# EAGLE design INTERFACE (EAGLE 6.2)
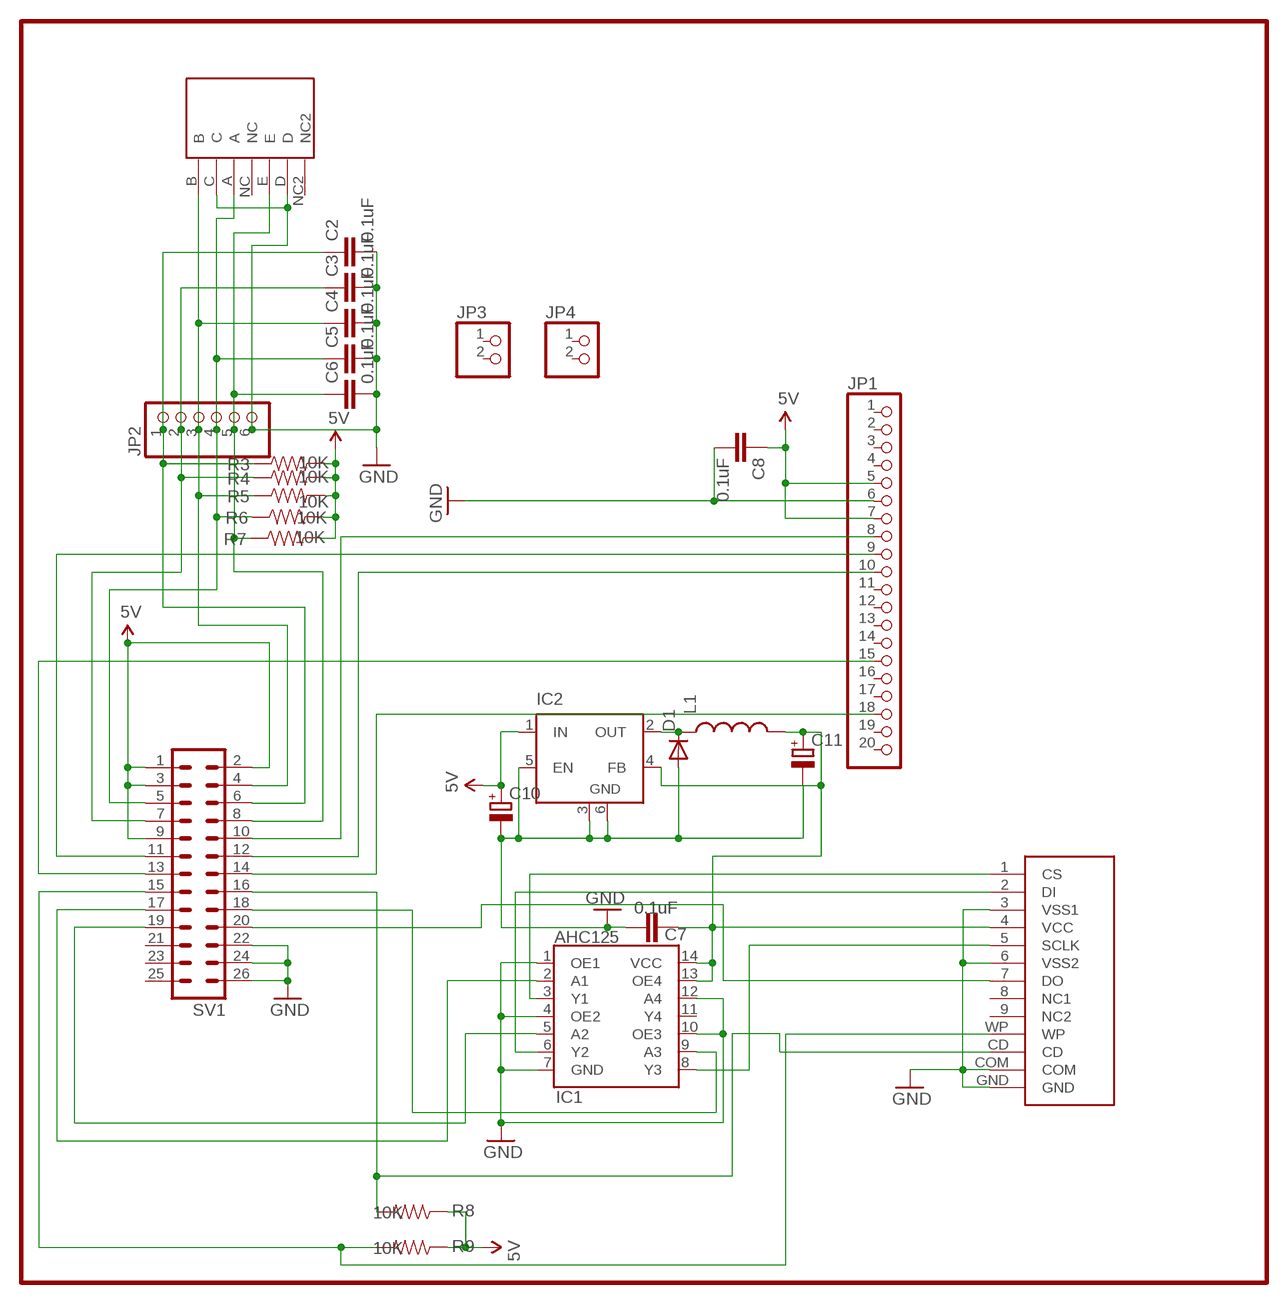
[diagram p0: schematic, sheet 1]

## Parts
C2  0.1uF  CAP0805  [0805]
C3  0.1uF  CAP0805  [0805]
C4  0.1uF  CAP0805  [0805]
C5  0.1uF  CAP0805  [0805]
C6  0.1uF  CAP0805  [0805]
C7  0.1uF  CAP0805  [0805]
C8  0.1uF  CAP0805  [0805]
C10  CPOL-EUE3.5-8  [E3,5-8]
C11  CPOL-EUE3.5-8  [E3,5-8]
D1  DIODESMB  [SMB-DIODE]
IC1  AHC125  [DIN14]
IC2  LM2596S  [TO263-5]
JP1  PINHD-1X20  [1X20]
JP2  PINHD-1X6  [1X06]
JP3  PINHD-1X2  [1X02]
JP4  PINHD-1X2  [1X02]
L1  INDUCTORPWR  [CDRH125]
Q2  SDCARD  [SDCARD]
R3  10K  RESISTOR  [0805]
R4  10K  RESISTOR  [0805]
R5  10K  RESISTOR  [0805]
R6  10K  RESISTOR  [0805]
R7  10K  RESISTOR  [0805]
R8  10K  RESISTOR  [0805]
R9  10K  RESISTOR  [0805]
S2  DJFS  [PIN5]
SV1  ML26  [ML26]

## Nets
5V: C8.1 C10.+ IC2.1(IN) JP1.5 JP1.7 R3.2 R4.2 R5.2 R6.2 R7.2 R8.1 R9.1 SV1.1 SV1.2 SV1.3 SV1.9
GND2: C2.2 C3.2 C4.2 C5.2 C6.2 C7.2 C8.2 C10.- C11.- D1.A IC1.1(OE1) IC1.4(OE2) IC1.7(GND) IC1.10(OE3) IC1.12(A4) IC2.3(GND) IC2.5(EN) IC2.6(GND) JP1.6 JP2.6 Q2.3(VSS1) Q2.6(VSS2) Q2.COM Q2.GND S2.C S2.D SV1.22 SV1.24 SV1.26 ; supply symbol labelled GND
N$1: D1.C IC2.2(OUT) L1.1
N$2: IC1.3(Y1) Q2.1(CS)
N$5: C2.1 JP2.1 R3.1 SV1.6
N$8: IC1.2(A1) SV1.17
N$10: IC1.6(Y2) Q2.2(DI)
N$12: Q2.CD R8.2 SV1.16
N$13: Q2.7(DO) SV1.20
N$18: JP1.15 SV1.13
N$19: JP1.8 SV1.10
N$20: JP1.10 SV1.12
N$21: JP1.9 SV1.11
N$22: JP1.18 SV1.14
N$23: IC1.8(Y3) Q2.5(SCLK)
N$27: C3.1 JP2.2 R4.1 SV1.7
N$28: C4.1 JP2.3 R5.1 S2.B SV1.4
N$29: C5.1 JP2.4 R6.1 S2.A SV1.5
N$30: C6.1 JP2.5 R7.1 S2.E SV1.8
N$31: Q2.WP R9.2 SV1.15
N$33: IC1.5(A2) SV1.19
N$34: C7.1 C11.+ IC1.13(OE4) IC1.14(VCC) IC2.4(FB) L1.2 Q2.4(VCC)
N$35: IC1.9(A3) SV1.18
Unconnected: IC1.11(Y4) JP1.1 JP1.2 JP1.3 JP1.4 JP1.11 JP1.12 JP1.13 JP1.14 JP1.16 JP1.17 JP1.19 JP1.20 JP3.1 JP3.2 JP4.1 JP4.2 Q2.8(NC1) Q2.9(NC2) S2.NC S2.NC2 SV1.21 SV1.23 SV1.25

## Library data of the parts
C2-C8 = SparkFun2:CAP: Capacitor Standard 0603 ceramic capacitor, and 0.1" leaded capacitor.
C10 C11 = rcl:CPOL-EU: POLARIZED CAPACITOR, European symbol
D1 = SparkFun:DIODE: Diode These are standard reverse protection diodes and small signal diodes. SMA package can handle up to about 1A. SOD-323 can handle about 200mA. What the SOD-323 package when ordering, there are some mfgs out there that are 5-pin packages.
IC1 = ahc:AHC125
IC2 = linear:LM2596S: STEP-DOWN VOLTAGE REGULATOR
JP1 = pinhead:PINHD-1X20: PIN HEADER
JP2 = pinhead:PINHD-1X6: PIN HEADER
JP3 JP4 = pinhead:PINHD-1X2: PIN HEADER
L1 = SparkFun:INDUCTOR: Inductors Basic Inductor/Choke - 0603 and 1206. Footprints are not proven and vary greatly between part numbers.
Q2 = sd:SDCARD
R3-R9 = SparkFun:RESISTOR: Resistor Basic schematic elements and footprints for 0603, 1206, and PTH 1/10th watt (small) resistors.
S2 = yjfs:DJFS
SV1 = con-harting-ml:ML26: HARTING; OC_FARNELL: unknown; OC_NEWARK: unknown

## Net classes
0 default: width 0.203 mm, drill 0.508 mm, clearance 0.203 mm
1 5V: width 0.381 mm, drill 0.508 mm, clearance 0.254 mm
2 gnd: width 0.381 mm, drill 0.508 mm, clearance 0.254 mm
3 3.3V: width 0.381 mm, drill 0.508 mm, clearance 0.254 mm

## Board
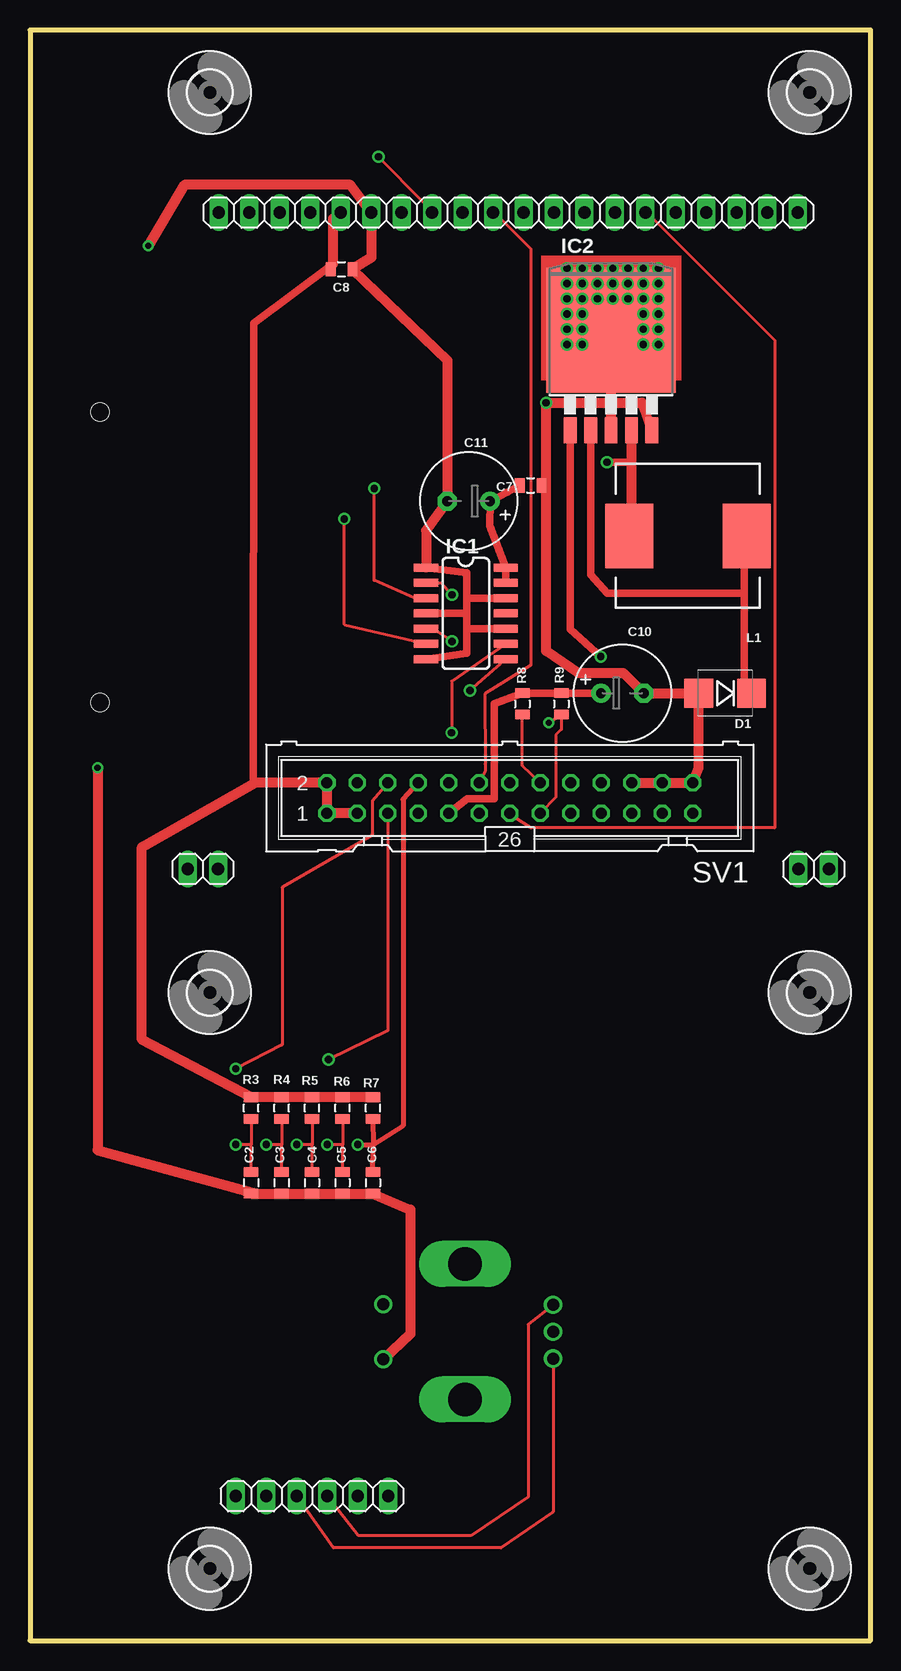
[diagram p1: board, top side]
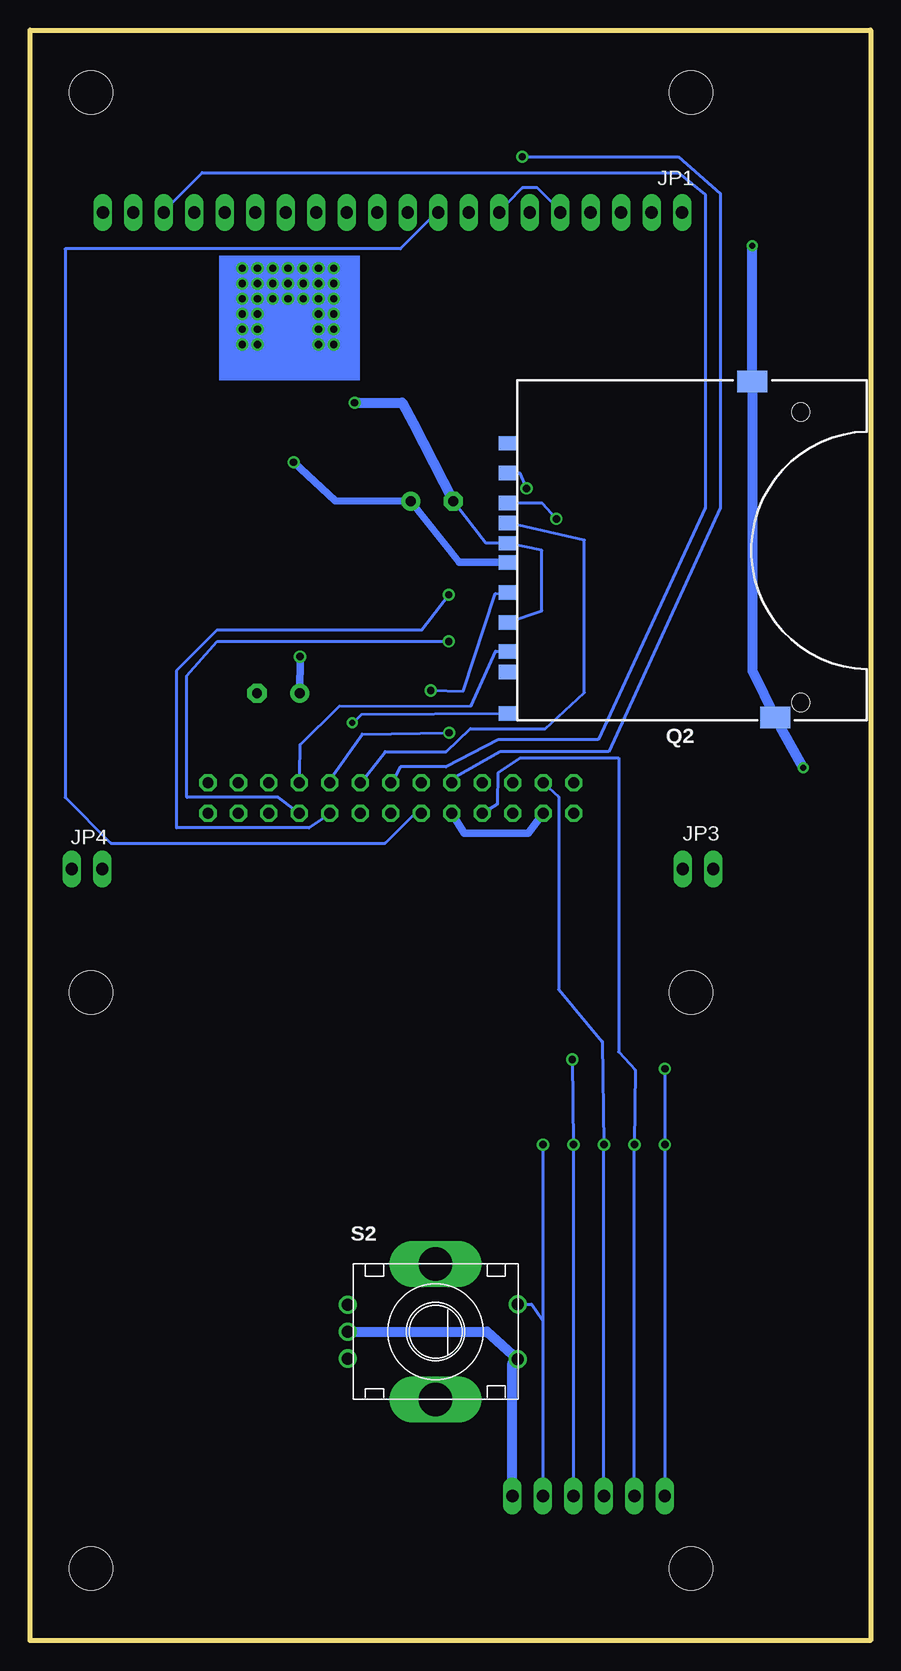
[diagram p2: board, bottom side, seen from below]

Size 70.06 x 134.21 mm. Coordinates in mm from the lower left corner, seen from the top.
Outline: 0,0 70.06,0 70.06,134.21 0,134.21 0,0
Copper layers (1*16): Top 0.035mm / dielectric 1.5mm / Bottom 0.035mm
Design rules: minimum track width 10mil, minimum drill 24mil, track to track 8mil, track to pad 8mil, pad to pad 8mil, via to via 8mil, smd to smd 8mil, copper to edge 40mil, drill to drill 8mil, minimum pad ring 10mil, minimum via ring 8mil, stop-mask expansion 4mil, vias tented up to drill 0mil, thermal gap 10mil

### Footprints (pad centres in the part's own frame; a part is rotated, then mirrored left to right if it is on the bottom)
0805 = smd 0.8 x 1.2: 1 -0.9,0; 2 0.9,0
E3,5-8 = drill 0.813 pad 1.6: + -1.778,0 | drill 0.813 pad 1.6 octagon: - 1.778,0
SMB-DIODE = smd 2.4 x 2.4: A 2.2,0; C -2.2,0
DIN14 = smd 0.66 x 2.032: 1 -3.175,-3.315; 2 -1.905,-3.315; 3 -0.635,-3.315; 4 0.635,-3.315; 5 1.905,-3.315; 6 3.175,-3.315; 7 4.445,-3.315; 8 4.445,3.315; 9 3.175,3.315; 10 1.905,3.315; 11 0.635,3.315; 12 -0.635,3.315; 13 -1.905,3.315; 14 -3.175,3.315
TO263-5 = smd 1.067 x 2.159: 1 -3.404,-5.791; 2 -1.702,-5.791; 3 0,-5.791; 4 1.702,-5.791; 5 3.404,-5.791 | smd 10.8 x 10.41: 6 0,2.54
1X20 = drill 1.016 long: 1 -24.13,0; 2 -21.59,0; 3 -19.05,0; 4 -16.51,0; 5 -13.97,0; 6 -11.43,0; 7 -8.89,0; 8 -6.35,0; 9 -3.81,0; 10 -1.27,0; 11 1.27,0; 12 3.81,0; 13 6.35,0; 14 8.89,0; 15 11.43,0; 16 13.97,0; 17 16.51,0; 18 19.05,0; 19 21.59,0; 20 24.13,0
1X06 = drill 1.016 long: 1 -6.35,0; 2 -3.81,0; 3 -1.27,0; 4 1.27,0; 5 3.81,0; 6 6.35,0
1X02 = drill 1.016 long: 1 -1.27,0; 2 1.27,0
CDRH125 = smd 5.4 x 4: 1 0,4.9; 2 0,-4.9
SDCARD = smd 1.2 x 1.5: 1 5.74,13.411; 2 3.251,13.411; 3 -0.102,13.411; 4 -1.702,13.411; 5 -4.216,13.411; 6 -6.706,13.411; 7 -9.119,13.411; 8 -10.82,13.411; 9 8.23,13.411; CD 1.6,13.411; WP -14.3,13.411 | smd 1.779 x 2.5: COM -14.624,-8.91; GND 13.386,-6.985 | hole 1.5: -13.37,-11.01; 10.83,-11.01
PIN5 = drill 1: A 3.409,-0.45; B 7.891,-0.45; C 5.65,-0.45; D 7.942,13.716; E 3.358,13.716 | drill 2.8 long: NC 0,6.875; NC2 11.3,6.875
ML26 = drill 0.914 octagon: 1 -15.24,-1.27; 2 -15.24,1.27; 3 -12.7,-1.27; 4 -12.7,1.27; 5 -10.16,-1.27; 6 -10.16,1.27; 7 -7.62,-1.27; 8 -7.62,1.27; 9 -5.08,-1.27; 10 -5.08,1.27; 11 -2.54,-1.27; 12 -2.54,1.27; 13 0,-1.27; 14 0,1.27; 15 2.54,-1.27; 16 2.54,1.27; 17 5.08,-1.27; 18 5.08,1.27; 19 7.62,-1.27; 20 7.62,1.27; 21 10.16,-1.27; 22 10.16,1.27; 23 12.7,-1.27; 24 12.7,1.27; 25 15.24,-1.27; 26 15.24,1.27
3,6 = hole 3.6: 0,0

### Placement (x,y rotation side)
C2  18.42,38.15 270 top
C3  20.96,38.15 270 top
C4  23.5,38.15 270 top
C5  26.04,38.15 270 top
C6  28.58,38.15 270 top
C7  41.71,96.27 0 top
C8  25.97,114.27 0 top
C10  49.36,78.94 0 top
C11  36.56,94.95 180 top
D1  57.92,78.94 180 top
IC1  36.33,86.23 270 top
IC2  48.42,106.65 0 top
JP1  39.86,119 0 top
JP2  23.5,12.04 0 top
JP3  14.4,64.3 0 top
JP4  65.31,64.3 0 top
L1  54.82,92.05 270 top
Q2  16.85,91.54 90 bottom
R3  18.42,44.37 90 top
R4  20.96,44.37 90 top
R5  23.5,44.37 90 top
R6  26.04,44.37 90 top
R7  28.58,44.37 90 top
R8  41.03,78.05 270 top
R9  44.28,78.05 270 top
S2  43.14,31.39 270 bottom
SV1  39.99,70.21 0 top
U$7  [3,6]  14.99,129.01 0 top
U$9  [3,6]  64.98,129.01 0 top
U$14  [3,6]  14.99,54 0 top
U$15  [3,6]  64.98,54 0 top
U$16  [3,6]  14.99,5.99 0 top
U$17  [3,6]  64.98,5.99 0 top

### Tracks (layer width: path | path; a pad name or v marks a point on that pad's centre or on a via)
5V  (via drill 0.61)
  Top 0.254: 25.23,71.53 SV1.2 | 25.23,114.71 C8.1 | 18.62,71.53 18.88,71.53 18.75,71.48
  Top 0.61: 25.23,118.52 JP1.5 | 25.23,114.71 18.65,109.75 18.62,71.53 18.62,71.39 | SV1.9 36.46,70.13 38.69,70.13 38.69,78.08 R8.1 R9.1 C10.+ | IC2.1 45.02,84.28 v47.56,81.99
  Top 0.813: R7.2 R6.2 R5.2 R4.2 R3.2 9.33,50.07 9.33,66.12 18.75,71.48 SV1.2 SV1.1 SV1.3 | 25.23,118.52 25.23,114.71
  Bottom 0.254: JP1.7 30.31,119.79 29.04,121.06 27.77,121.06 26.5,119.79 JP1.5
  Bottom 0.61: SV1.3 28.56,67.26 33.89,67.28 SV1.9 | C10.+ v47.56,81.99
GND2  (via drill 0.51, 0.61)
  Top 0.254: 51.9,100.74 IC2.5 | 55.71,79.15 D1.A | 18.88,37.24 C2.2 | C7.2 43.01,96.39
  Top 0.61: IC1.7 36.38,82.27 36.38,84.33 | 36.38,84.33 36.38,85.6 | 36.38,85.6 36.38,86.87 | 36.38,86.87 36.38,88.98 IC1.1 | IC1.4 36.38,85.6 | IC1.12 36.38,86.87 | IC1.10 36.38,84.33
  Top 0.813: C2.2 C3.2 C4.2 C5.2 C6.2 31.71,35.9 31.71,25.55 S2.D | 51.9,100.74 51.01,103.15 48.42,103.15 | 18.88,37.24 5.63,40.87 v5.63,72.75 | v9.86,116.23 12.86,121.31 26.7,121.31 JP1.6 28.46,115.24 C8.2 34.78,106.68 C11.- 33.01,92.51 IC1.1 | 48.42,103.15 v43.01,103.15 43.01,96.39 43.01,82.47 45.68,80.64 49.44,80.64 C10.- D1.A 55.72,72.72 SV1.26 SV1.24 SV1.22 | IC2.3 48.42,103.15 | 48.42,103.15 IC2.6
  Bottom 0.254: Q2.6 27.41,85.83 27.41,90.86 Q2.3 32.06,91.44 C11.-
  Bottom 0.813: v43.01,103.15 39.05,103.15 38.11,101.42 C11.- | S2.C 31.96,25.74 S2.D 29.85,23.12 JP2.6 | v5.63,72.75 Q2.COM 9.86,80.8 Q2.GND v9.86,116.23
N$1
  Top 0.254: 59.52,91.85 L1.1
  Top 0.61: 59.52,87.27 48.09,87.27 46.72,88.8 IC2.2 | 59.52,91.85 59.52,87.27 | 59.52,87.27 59.52,79.15 D1.C
N$2  (via drill 0.61)
  Top 0.254: v28.68,96.01 28.68,88.34 32.06,86.84 IC1.3
  Bottom 0.254: v28.68,96.01 29.22,97.26 Q2.1
N$5  (via drill 0.61)
  Top 0.254: C2.1 18.42,41.3 | 18.42,41.3 v17.15,41.33 | R3.1 18.42,41.3 | v17.15,47.65 21.01,49.63 21.01,62.76 28.53,67.11 28.53,69.98 SV1.6
  Bottom 0.254: JP2.1 v17.15,41.33 v17.15,47.65
N$8  (via drill 0.61)
  Top 0.254: IC1.2 34.27,88.14 v35.16,87.15
  Bottom 0.254: v35.16,87.15 37.4,84.23 54.44,84.23 57.87,80.8 57.87,67.69 57.84,67.72 46.82,67.72 45.57,68.58 SV1.17
N$10  (via drill 0.61)
  Top 0.254: v26.19,93.47 26.19,84.66 IC1.6
  Bottom 0.254: v26.19,93.47 27.36,94.77 Q2.2
N$12
  Top 0.254: SV1.16 41.03,72.9 R8.2
  Bottom 0.254: SV1.16 42.12,71.96 40.47,74.07 35.39,74.07 33.36,76 27.11,76 23.86,78.99 23.86,91.69 Q2.CD
N$13
  Bottom 0.254: Q2.7 31.25,82.45 33.28,77.9 44.28,77.88 47.56,74.65 47.58,72.16 SV1.20
N$18
  Top 0.254: SV1.13 40.44,68.55 41.74,67.72 62.06,67.72 62.06,108.36 51.9,118.52 JP1.15
N$19  (via drill 0.61)
  Top 0.254: v29.04,123.65 32.85,119.79 JP1.8
  Bottom 0.254: v29.04,123.65 16.06,123.65 12.53,120.57 12.53,94.39 21.85,74.07 30.87,74.07 34.91,71.75 SV1.10
N$20
  Top 0.254: SV1.12 37.95,72.49 37.93,73.02 37.9,78.89 41.74,81.28 41.74,115.98 39.2,118.52 JP1.10
N$21
  Bottom 0.254: SV1.11 37.93,68.99 40.47,66.45 63.33,66.45 67.14,70.26 67.14,115.98 39.2,115.98 36.66,118.52 JP1.9
N$22
  Bottom 0.254: SV1.14 39.68,71.96 39.2,72.8 35.39,72.8 31.05,75.08 22.71,75.08 13.8,94.39 13.8,120.5 16.06,122.33 55.71,122.33 58.25,119.79 JP1.18
N$23  (via drill 0.61)
  Top 0.254: v36.66,79.17 39.17,81.41 IC1.8
  Bottom 0.254: v36.66,79.17 33.97,79.12 31.27,87.25 Q2.5
N$27  (via drill 0.61)
  Top 0.254: R4.1 20.96,41.33 | 20.96,41.33 v19.69,41.33 | C3.1 20.96,41.33
  Bottom 0.254: SV1.7 31.73,69.32 31.1,69.72 31.05,72.31 29.17,73.56 21.01,73.56 21.01,49.05 19.64,47.55 v19.69,41.33 JP2.2
N$28  (via drill 0.61)
  Top 0.254: C4.1 23.5,41.33 | 23.5,41.33 v22.23,41.33 | R5.1 23.5,41.33 | S2.B 43.59,10.74 39.24,7.72 25.28,7.72 JP2.3
  Bottom 0.254: JP2.3 v22.23,41.33 22.36,49.91 26.02,54.25 26.02,70.31 SV1.4
N$29  (via drill 0.61)
  Top 0.254: SV1.5 29.8,68.38 29.8,50.8 v24.87,48.41 | R6.1 26.04,41.33 | 26.04,41.33 v24.77,41.33 | C5.1 26.04,41.33 | S2.A 41.51,26.34 41.51,11.96 36.72,8.74 27.36,8.74 JP2.4
  Bottom 0.254: JP2.4 v24.77,41.33 v24.87,48.41
N$30  (via drill 0.61)
  Top 0.406: v27.31,41.33 28.59,41.33 | 28.59,41.33 31.1,42.9 31.1,70.1 SV1.8 | C6.1 28.59,41.33 | R7.1 28.59,41.33
  Bottom 0.254: v27.31,41.33 27.31,26.67 | 27.31,26.67 JP2.5 | S2.E 28.25,28.03 27.31,26.67
N$31  (via drill 0.51)
  Top 0.254: SV1.15 43.8,70.26 43.82,75.46 44.28,75.92 R9.2 v43.21,76.48
  Bottom 0.254: Q2.WP 42.45,77.17 43.14,76.48 v43.21,76.48
N$33  (via drill 0.61)
  Top 0.254: IC1.5 33.61,84.33 v35.16,83.26
  Bottom 0.254: v35.16,83.26 54.44,83.26 56.98,80.42 56.98,70.26 49.36,70.26 48.01,69.21 SV1.19
N$34  (via drill 0.61)
  Top 0.61: C7.1 39.76,95.68 C11.+ 38.31,92.89 IC1.14 IC1.13 | v48.09,98.2 50.12,98.2
  Top 0.813: IC2.4 50.12,98.2 50.12,92.25 L1.2
  Bottom 0.61: Q2.4 34.27,89.84 C11.+ 44.61,94.97 v48.09,98.2
N$35  (via drill 0.61)
  Top 0.254: IC1.9 35.14,79.96 v35.14,75.64
  Bottom 0.254: v35.14,75.64 42.37,75.54 44.94,71.91 SV1.18
N$109  (via drill 0.6 pad 0)
  other vias: 51.1,108
N$134  (via drill 0.6 pad 0)
  other vias: 51.1,109.27
N$180  (via drill 0.6 pad 0)
  other vias: 52.37,108
N$206  (via drill 0.6 pad 0)
  other vias: 51.1,110.54
N$213  (via drill 0.6 pad 0)
  other vias: 52.37,109.27
N$214  (via drill 0.6 pad 0)
  other vias: 52.37,110.54
N$215  (via drill 0.6 pad 0)
  other vias: 51.1,111.81
N$216  (via drill 0.6 pad 0)
  other vias: 49.83,111.81
N$217  (via drill 0.6 pad 0)
  other vias: 52.37,113.08
N$218  (via drill 0.6 pad 0)
  other vias: 52.37,111.81
N$219  (via drill 0.6 pad 0)
  other vias: 51.1,113.08
N$223  (via drill 0.6 pad 0)
  other vias: 49.83,113.08
N$224  (via drill 0.6 pad 0)
  other vias: 52.37,114.35
N$227  (via drill 0.6 pad 0)
  other vias: 49.83,114.35
N$228  (via drill 0.6 pad 0)
  other vias: 51.1,114.35
N$232  (via drill 0.6 pad 0)
  other vias: 48.56,113.08
N$233  (via drill 0.6 pad 0)
  other vias: 48.56,111.81
N$234  (via drill 0.6 pad 0)
  other vias: 47.29,113.08
N$235  (via drill 0.6 pad 0)
  other vias: 46.02,114.35
N$236  (via drill 0.6 pad 0)
  other vias: 47.29,114.35
N$237  (via drill 0.6 pad 0)
  other vias: 48.56,114.35
N$238  (via drill 0.6 pad 0)
  other vias: 46.02,113.08 46.02,113.08
N$239  (via drill 0.6 pad 0)
  other vias: 44.75,113.08
N$240  (via drill 0.6 pad 0)
  other vias: 44.75,114.35
N$241  (via drill 0.6 pad 0)
  other vias: 44.75,111.81
N$242  (via drill 0.6 pad 0)
  other vias: 47.29,111.81
N$243  (via drill 0.6 pad 0)
  other vias: 46.02,111.81
N$244  (via drill 0.6 pad 0)
  other vias: 46.02,110.54
N$245  (via drill 0.6 pad 0)
  other vias: 44.75,110.54
N$246  (via drill 0.6 pad 0)
  other vias: 44.75,109.27
N$247  (via drill 0.6 pad 0)
  other vias: 46.02,109.27
N$248  (via drill 0.6 pad 0)
  other vias: 46.02,108
N$249  (via drill 0.6 pad 0)
  other vias: 44.75,108
(copper drawn outside any net)
  shapes: Bottom area x1, Top area x1

### Text on the board
bNames: S2
tTest: VCC | GND | VCC | RS | RST | CS | D3 | D0 | RIGHT | ENTER | LEFT | DOWN | GND | UP